# Altium project OLED_0.96-inch.PrjPCB
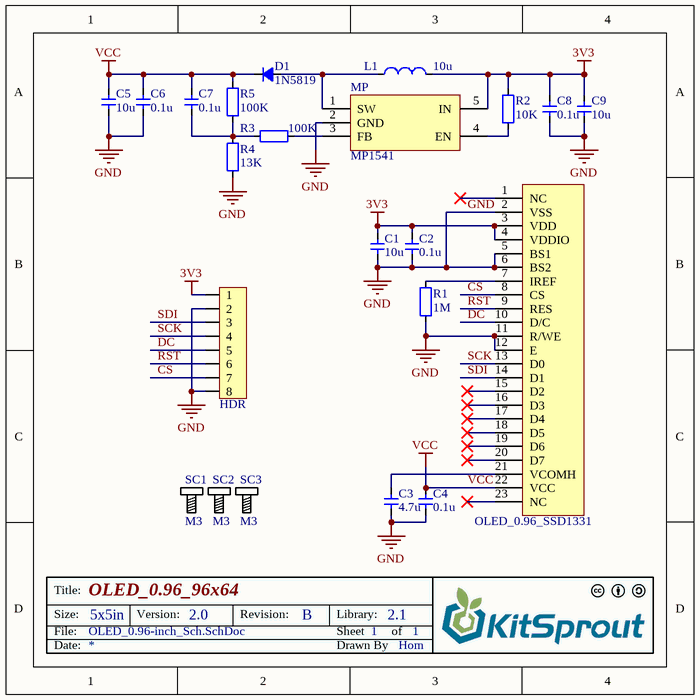
[diagram p0: OLED_0.96-inch_Sch.SchDoc]
1 sheet, 22 parts. Net scope: global (net labels, ports and power ports of the same name join across sheets).
Board file: OLED_0.96-inch_Pcb.PcbDoc

## Sheet OLED_0.96-inch_Sch.SchDoc: OLED_0.96_96x64
size 127 x 127 mm; Author: Hom; CompanyName: KitSprout; DrawnBy: Hom; Engineer: Hom; Organization: KitSprout; Revision: B; SheetNumber: 1; SheetTotal: 1; Version: 2.0; LibVersion: 2.1; PageSetup: Record=PageOptions|CenterHorizontal=True|CenterVertical=True|PrintScale=1.00|XCorrection=1.00|YCorrection=1.00|PrintKind=0|BorderSize=5000000|LeftOffset=0|BottomOffset=0|Orientation=2|PaperLength=1000|PaperWidth=1000|Scale=100|PaperSource=7|PrintQuality=-3|MediaType=1|DitherType=10|PrintScaleMode=0|PaperKind=A4|PaperIndex=9

### Parts
C1  value 10u  [CAP_0805]  (hidden comment: Cap_0805)
C2  value 0.1u  [CAP_0805]  (hidden comment: Cap_0805)
C3  value 4.7u  [CAP_0805]  (hidden comment: Cap_0805)
C4  value 0.1u  [CAP_0805]  (hidden comment: Cap_0805)
C5  value 10u  [CAP_0805]  (hidden comment: Cap_0805)
C6  value 0.1u  [CAP_0805]  (hidden comment: Cap_0805)
C7  value 0.1u  [CAP_0805]  (hidden comment: Cap_0805)
C8  value 0.1u  [CAP_0805]  (hidden comment: Cap_0805)
C9  value 10u  [CAP_0805]  (hidden comment: Cap_0805)
D1  value 1N5819  [DO-214AC]  (hidden comment: Diode_SMA)
HDR  HDR1x8_1.27  [HDR1X8_1.27_180]  (value not drawn)
L1  value 10u  [IND_CD32]  (hidden comment: Ind_CD32)
MP  MP1541  [SOT23-5]
OLED_0.96_SSD1331  OLED_0.96_SSD1331  [OLED_0.96_96x64_SSD1331]  (value not drawn)
R1  value 1M  [RES_0603]  (hidden comment: Res_0603)
R2  value 10K  [RES_0603]  (hidden comment: Res_0603)
R3  value 100K  [RES_0603]  (hidden comment: Res_0603)
R4  value 13K  [RES_0603]  (hidden comment: Res_0603)
R5  value 100K  [RES_0603]  (hidden comment: Res_0603)
SC1  M3  [SCRREW_M3]
SC2  M3  [SCRREW_M3]
SC3  M3  [SCRREW_M3]

### Nets
3V3: C1.2 C2.2 C8.2 C9.2 HDR.1 L1.2 MP.5(IN) OLED_0.96_SSD1331.3(VDD) OLED_0.96_SSD1331.4(VDDIO) R2.2
GND: C1.1 C2.1 C3.1 C4.1 C5.1 C6.1 C8.1 C9.1 HDR.2 HDR.8 MP.2(GND) OLED_0.96_SSD1331.2(VSS) OLED_0.96_SSD1331.5(BS1) OLED_0.96_SSD1331.6(BS2) OLED_0.96_SSD1331.11(R/WE) OLED_0.96_SSD1331.12(E) R1.1 R4.1
VCC: C4.2 C5.2 C6.2 C7.2 D1.2(K) OLED_0.96_SSD1331.22(VCC) R5.2
CS: HDR.7 OLED_0.96_SSD1331.8(CS)
DC: HDR.5 OLED_0.96_SSD1331.10(D/C)
RST: HDR.6 OLED_0.96_SSD1331.9(RES)
SCK: HDR.4 OLED_0.96_SSD1331.13(D0)
SDI: HDR.3 OLED_0.96_SSD1331.14(D1)
NetC3_2: C3.2 OLED_0.96_SSD1331.21(VCOMH)
NetC7_1: C7.1 R3.2 R4.2 R5.1
NetD1_1: D1.1(A) L1.1 MP.1(SW)
NetMP_3: MP.3(FB) R3.1
NetMP_4: MP.4(EN) R2.1
NetOLED_0.96_SSD1331_7: OLED_0.96_SSD1331.7(IREF) R1.2

Not connected (* = marked no-connect by the designer): OLED_0.96_SSD1331 1(NC)* 15(D2)* 16(D3)* 17(D4)* 18(D5)* 19(D6)* 20(D7)* 23(NC)*

### Notes on the sheet
- Title:
- Size:
- Date:
- File:
- 5x5in
- Version:
- Revision:
- Sheet
- Drawn By
- Library:
- of

### Library data of the parts
C1-C9 = Cap_0805: Capacitor
D1 = Diode_SMA: Diode
HDR = HDR1x8_1.27: Header
L1 = Ind_CD32: Inductor
MP = MP1541: Boost
OLED_0.96_SSD1331 = OLED_0.96_SSD1331: OLED
R1-R5 = Res_0603: Resistor
SC1-SC3 = Screw_M3: Screw